# Altium schematic sheet PL_Conenctor.schDoc
size A3; SheetNumber: 1; SheetTotal: 13
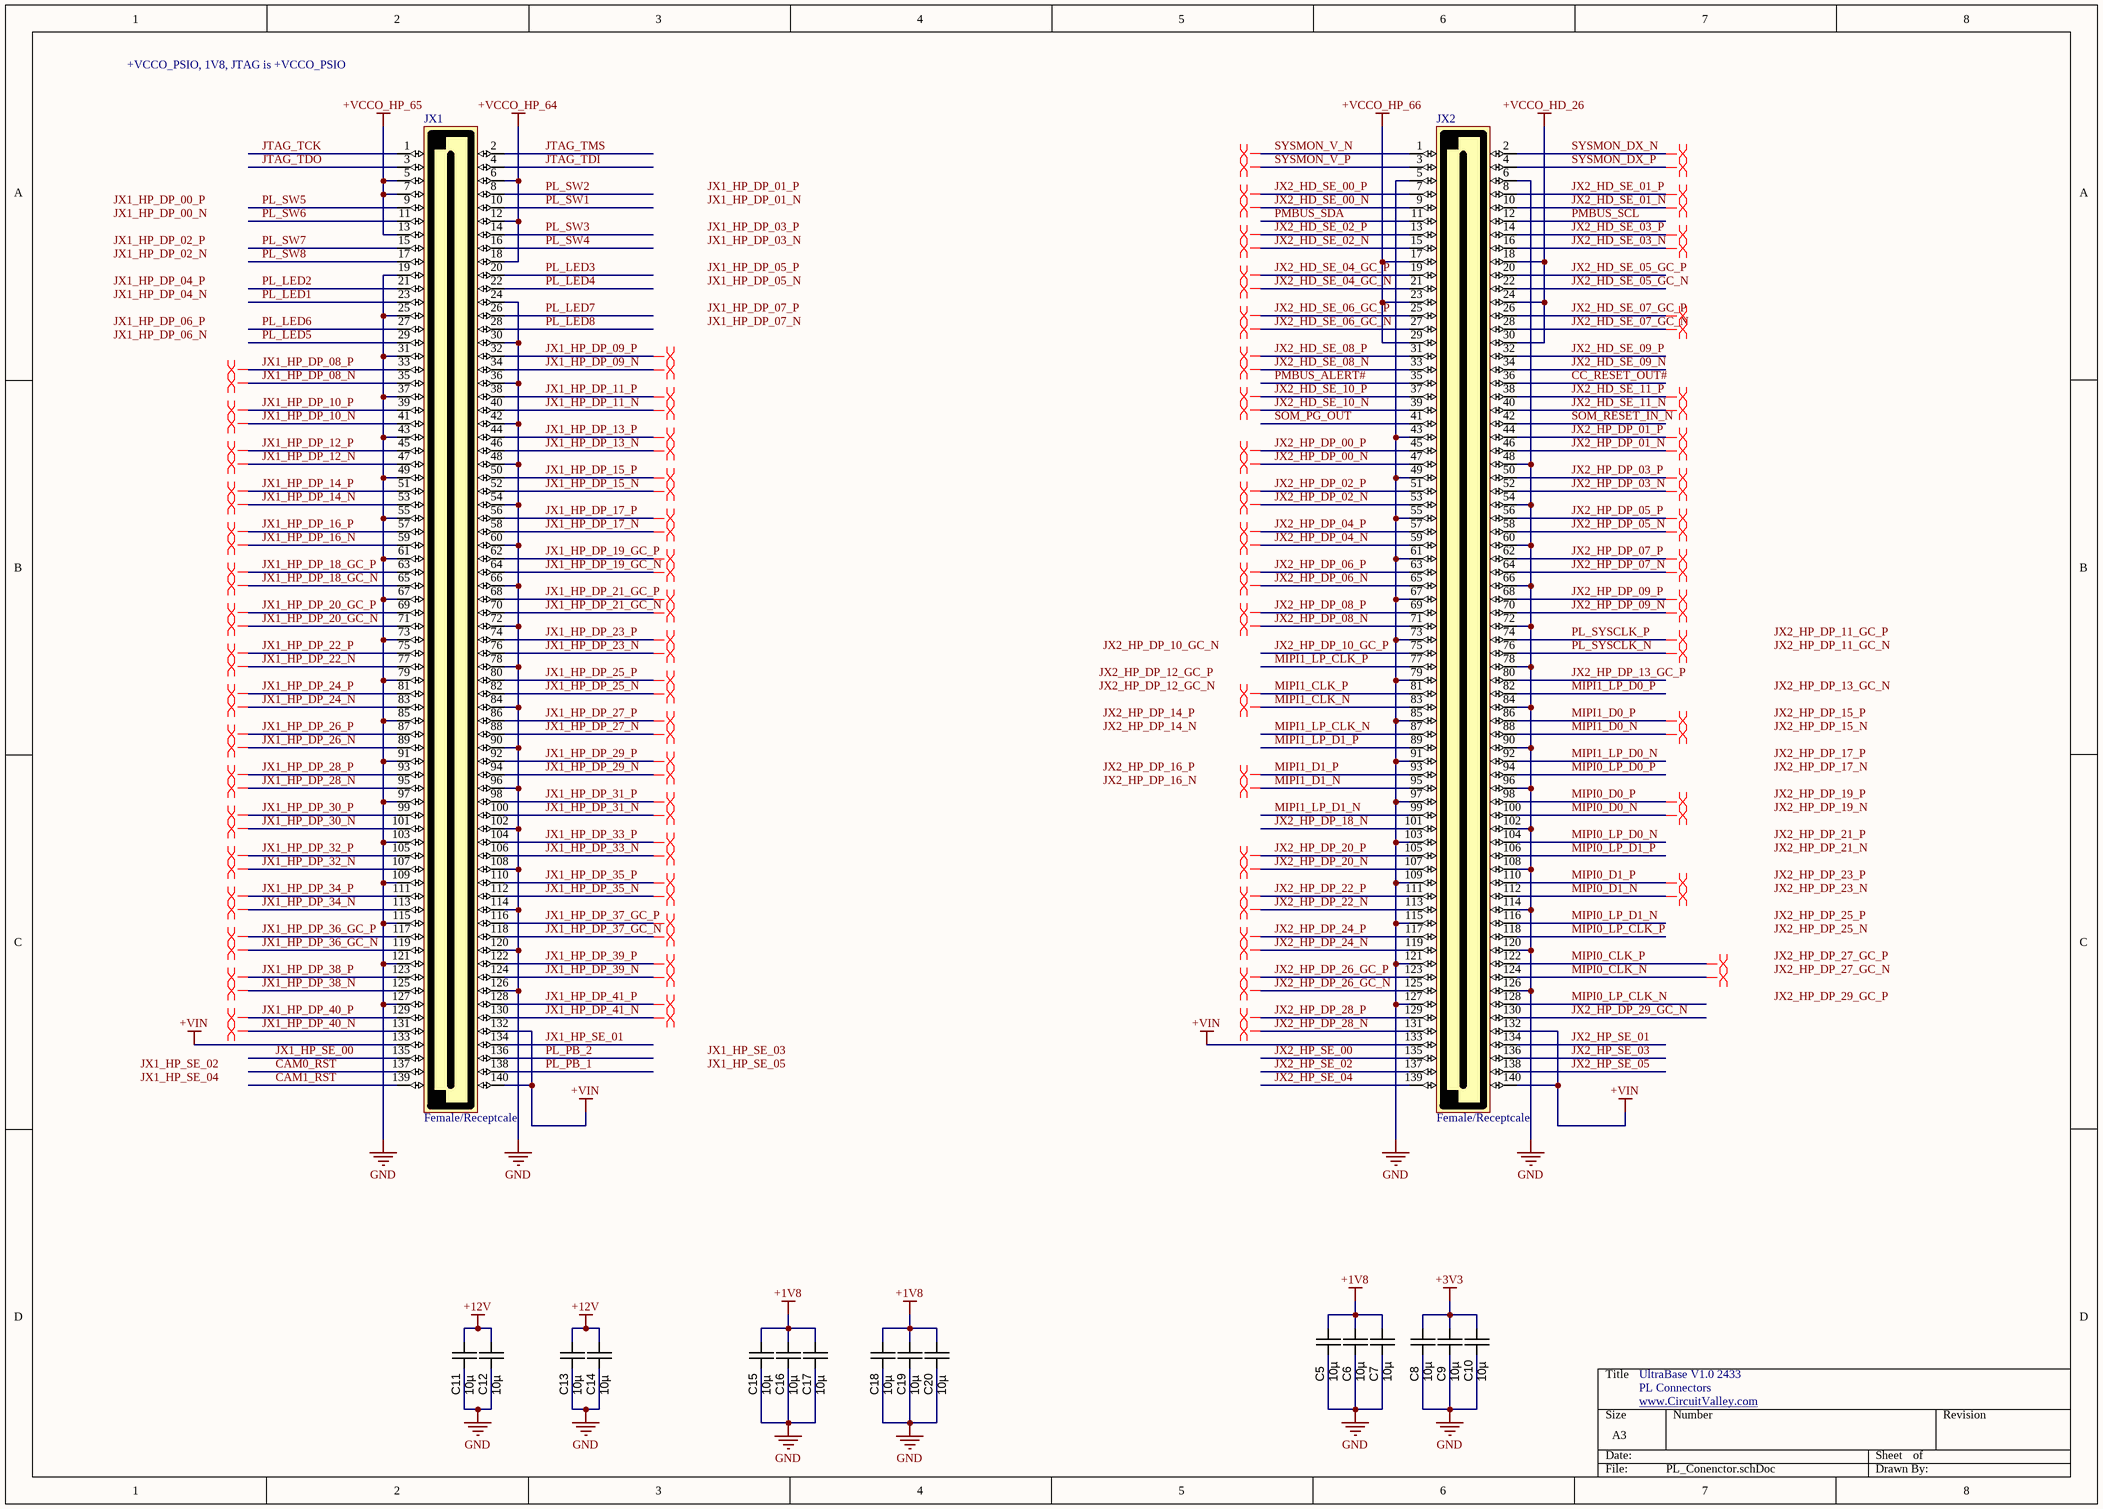
[diagram p0: PL_Conenctor.schDoc]

## Parts
C5  10µ  [CAPC3225N]
C6  10µ  [CAPC3225N]
C7  10µ  [CAPC3225N]
C8  10µ  [CAPC3225N]
C9  10µ  [CAPC3225N]
C10  10µ  [CAPC3225N]
C11  10µ  [CAPC3225N]
C12  10µ  [CAPC3225N]
C13  10µ  [CAPC3225N]
C14  10µ  [CAPC3225N]
C15  10µ  [CAPC3225N]
C16  10µ  [CAPC3225N]
C17  10µ  [CAPC3225N]
C18  10µ  [CAPC3225N]
C19  10µ  [CAPC3225N]
C20  10µ  [CAPC3225N]
JX1  Female/Receptcale  [5177985-6]
JX2  Female/Receptcale  [5177985-6]

## Nets
+1V8: C5.1 C6.1 C7.1 C15.1 C16.1 C17.1 C18.1 C19.1 C20.1
+3V3: C8.1 C9.1 C10.1
+12V: C11.1 C12.1 C13.1 C14.1
+VCCO_HD_26: JX2.18 JX2.24 JX2.30
+VCCO_HP_64: JX1.6 JX1.12 JX1.18
+VCCO_HP_65: JX1.5 JX1.7 JX1.13
+VCCO_HP_66: JX2.17 JX2.23 JX2.29
+VIN: JX1.132 JX1.133 JX1.140 JX2.132 JX2.133 JX2.140
GND: C5.2 C6.2 C7.2 C8.2 C9.2 C10.2 C11.2 C12.2 C13.2 C14.2 C15.2 C16.2 C17.2 C18.2 C19.2 C20.2 JX1.19 JX1.24 JX1.25 JX1.30 JX1.31 JX1.36 JX1.37 JX1.42 JX1.43 JX1.48 JX1.49 JX1.54 JX1.55 JX1.60 JX1.61 JX1.66 JX1.67 JX1.72 JX1.73 JX1.78 JX1.79 JX1.84 JX1.85 JX1.90 JX1.91 JX1.96 JX1.97 JX1.102 JX1.103 JX1.108 JX1.109 JX1.114 JX1.115 JX1.120 JX1.121 JX1.126 JX1.127 JX2.5 JX2.6 JX2.43 JX2.48 JX2.49 JX2.54 JX2.55 JX2.60 JX2.61 JX2.66 JX2.67 JX2.72 JX2.73 JX2.78 JX2.79 JX2.84 JX2.85 JX2.90 JX2.91 JX2.96 JX2.97 JX2.102 JX2.103 JX2.108 JX2.109 JX2.114 JX2.115 JX2.120 JX2.121 JX2.126 JX2.127
CAM0_RST: JX1.137
CAM1_RST: JX1.139
CC_RESET_OUT#: JX2.36
JTAG_TCK: JX1.1
JTAG_TDI: JX1.4
JTAG_TDO: JX1.3
JTAG_TMS: JX1.2
JX1_HP_DP_08_N: JX1.35
JX1_HP_DP_08_P: JX1.33
JX1_HP_DP_09_N: JX1.34
JX1_HP_DP_09_P: JX1.32
JX1_HP_DP_10_N: JX1.41
JX1_HP_DP_10_P: JX1.39
JX1_HP_DP_11_N: JX1.40
JX1_HP_DP_11_P: JX1.38
JX1_HP_DP_12_N: JX1.47
JX1_HP_DP_12_P: JX1.45
JX1_HP_DP_13_N: JX1.46
JX1_HP_DP_13_P: JX1.44
JX1_HP_DP_14_N: JX1.53
JX1_HP_DP_14_P: JX1.51
JX1_HP_DP_15_N: JX1.52
JX1_HP_DP_15_P: JX1.50
JX1_HP_DP_16_N: JX1.59
JX1_HP_DP_16_P: JX1.57
JX1_HP_DP_17_N: JX1.58
JX1_HP_DP_17_P: JX1.56
JX1_HP_DP_18_GC_N: JX1.65
JX1_HP_DP_18_GC_P: JX1.63
JX1_HP_DP_19_GC_N: JX1.64
JX1_HP_DP_19_GC_P: JX1.62
JX1_HP_DP_20_GC_N: JX1.71
JX1_HP_DP_20_GC_P: JX1.69
JX1_HP_DP_21_GC_N: JX1.70
JX1_HP_DP_21_GC_P: JX1.68
JX1_HP_DP_22_N: JX1.77
JX1_HP_DP_22_P: JX1.75
JX1_HP_DP_23_N: JX1.76
JX1_HP_DP_23_P: JX1.74
JX1_HP_DP_24_N: JX1.83
JX1_HP_DP_24_P: JX1.81
JX1_HP_DP_25_N: JX1.82
JX1_HP_DP_25_P: JX1.80
JX1_HP_DP_26_N: JX1.89
JX1_HP_DP_26_P: JX1.87
JX1_HP_DP_27_N: JX1.88
JX1_HP_DP_27_P: JX1.86
JX1_HP_DP_28_N: JX1.95
JX1_HP_DP_28_P: JX1.93
JX1_HP_DP_29_N: JX1.94
JX1_HP_DP_29_P: JX1.92
JX1_HP_DP_30_N: JX1.101
JX1_HP_DP_30_P: JX1.99
JX1_HP_DP_31_N: JX1.100
JX1_HP_DP_31_P: JX1.98
JX1_HP_DP_32_N: JX1.107
JX1_HP_DP_32_P: JX1.105
JX1_HP_DP_33_N: JX1.106
JX1_HP_DP_33_P: JX1.104
JX1_HP_DP_34_N: JX1.113
JX1_HP_DP_34_P: JX1.111
JX1_HP_DP_35_N: JX1.112
JX1_HP_DP_35_P: JX1.110
JX1_HP_DP_36_GC_N: JX1.119
JX1_HP_DP_36_GC_P: JX1.117
JX1_HP_DP_37_GC_N: JX1.118
JX1_HP_DP_37_GC_P: JX1.116
JX1_HP_DP_38_N: JX1.125
JX1_HP_DP_38_P: JX1.123
JX1_HP_DP_39_N: JX1.124
JX1_HP_DP_39_P: JX1.122
JX1_HP_DP_40_N: JX1.131
JX1_HP_DP_40_P: JX1.129
JX1_HP_DP_41_N: JX1.130
JX1_HP_DP_41_P: JX1.128
JX1_HP_SE_00: JX1.135
JX1_HP_SE_01: JX1.134
JX2_HD_SE_00_N: JX2.9
JX2_HD_SE_00_P: JX2.7
JX2_HD_SE_01_N: JX2.10
JX2_HD_SE_01_P: JX2.8
JX2_HD_SE_02_N: JX2.15
JX2_HD_SE_02_P: JX2.13
JX2_HD_SE_03_N: JX2.16
JX2_HD_SE_03_P: JX2.14
JX2_HD_SE_04_GC_N: JX2.21
JX2_HD_SE_04_GC_P: JX2.19
JX2_HD_SE_05_GC_N: JX2.22
JX2_HD_SE_05_GC_P: JX2.20
JX2_HD_SE_06_GC_N: JX2.27
JX2_HD_SE_06_GC_P: JX2.25
JX2_HD_SE_07_GC_N: JX2.28
JX2_HD_SE_07_GC_P: JX2.26
JX2_HD_SE_08_N: JX2.33
JX2_HD_SE_08_P: JX2.31
JX2_HD_SE_09_N: JX2.34
JX2_HD_SE_09_P: JX2.32
JX2_HD_SE_10_N: JX2.39
JX2_HD_SE_10_P: JX2.37
JX2_HD_SE_11_N: JX2.40
JX2_HD_SE_11_P: JX2.38
JX2_HP_DP_00_N: JX2.47
JX2_HP_DP_00_P: JX2.45
JX2_HP_DP_01_N: JX2.46
JX2_HP_DP_01_P: JX2.44
JX2_HP_DP_02_N: JX2.53
JX2_HP_DP_02_P: JX2.51
JX2_HP_DP_03_N: JX2.52
JX2_HP_DP_03_P: JX2.50
JX2_HP_DP_04_N: JX2.59
JX2_HP_DP_04_P: JX2.57
JX2_HP_DP_05_N: JX2.58
JX2_HP_DP_05_P: JX2.56
JX2_HP_DP_06_N: JX2.65
JX2_HP_DP_06_P: JX2.63
JX2_HP_DP_07_N: JX2.64
JX2_HP_DP_07_P: JX2.62
JX2_HP_DP_08_N: JX2.71
JX2_HP_DP_08_P: JX2.69
JX2_HP_DP_09_N: JX2.70
JX2_HP_DP_09_P: JX2.68
JX2_HP_DP_10_GC_P: JX2.75
JX2_HP_DP_13_GC_P: JX2.80
JX2_HP_DP_18_N: JX2.101
JX2_HP_DP_20_N: JX2.107
JX2_HP_DP_20_P: JX2.105
JX2_HP_DP_22_N: JX2.113
JX2_HP_DP_22_P: JX2.111
JX2_HP_DP_24_N: JX2.119
JX2_HP_DP_24_P: JX2.117
JX2_HP_DP_26_GC_N: JX2.125
JX2_HP_DP_26_GC_P: JX2.123
JX2_HP_DP_28_N: JX2.131
JX2_HP_DP_28_P: JX2.129
JX2_HP_DP_29_GC_N: JX2.130
JX2_HP_SE_00: JX2.135
JX2_HP_SE_01: JX2.134
JX2_HP_SE_02: JX2.137
JX2_HP_SE_03: JX2.136
JX2_HP_SE_04: JX2.139
JX2_HP_SE_05: JX2.138
MIPI0_CLK_N: JX2.124
MIPI0_CLK_P: JX2.122
MIPI0_D0_N: JX2.100
MIPI0_D0_P: JX2.98
MIPI0_D1_N: JX2.112
MIPI0_D1_P: JX2.110
MIPI0_LP_CLK_N: JX2.128
MIPI0_LP_CLK_P: JX2.118
MIPI0_LP_D0_N: JX2.104
MIPI0_LP_D0_P: JX2.94
MIPI0_LP_D1_N: JX2.116
MIPI0_LP_D1_P: JX2.106
MIPI1_CLK_N: JX2.83
MIPI1_CLK_P: JX2.81
MIPI1_D0_N: JX2.88
MIPI1_D0_P: JX2.86
MIPI1_D1_N: JX2.95
MIPI1_D1_P: JX2.93
MIPI1_LP_CLK_N: JX2.87
MIPI1_LP_CLK_P: JX2.77
MIPI1_LP_D0_N: JX2.92
MIPI1_LP_D0_P: JX2.82
MIPI1_LP_D1_N: JX2.99
MIPI1_LP_D1_P: JX2.89
PL_LED1: JX1.23
PL_LED2: JX1.21
PL_LED3: JX1.20
PL_LED4: JX1.22
PL_LED5: JX1.29
PL_LED6: JX1.27
PL_LED7: JX1.26
PL_LED8: JX1.28
PL_PB_1: JX1.138
PL_PB_2: JX1.136
PL_SW1: JX1.10
PL_SW2: JX1.8
PL_SW3: JX1.14
PL_SW4: JX1.16
PL_SW5: JX1.9
PL_SW6: JX1.11
PL_SW7: JX1.15
PL_SW8: JX1.17
PL_SYSCLK_N: JX2.76
PL_SYSCLK_P: JX2.74
PMBUS_ALERT#: JX2.35
PMBUS_SCL: JX2.12
PMBUS_SDA: JX2.11
SOM_PG_OUT: JX2.41
SOM_RESET_IN_N: JX2.42
SYSMON_DX_N: JX2.2
SYSMON_DX_P: JX2.4
SYSMON_V_N: JX2.1
SYSMON_V_P: JX2.3

## Layout directives
differential pair: JX1_HP_DP_08_N, JX1_HP_DP_08_P, JX1_HP_DP_09_N, JX1_HP_DP_09_P, JX1_HP_DP_10_N, JX1_HP_DP_10_P, JX1_HP_DP_11_N, JX1_HP_DP_11_P, JX1_HP_DP_12_N, JX1_HP_DP_12_P, JX1_HP_DP_13_N, JX1_HP_DP_13_P, JX1_HP_DP_14_N, JX1_HP_DP_14_P, JX1_HP_DP_15_N, JX1_HP_DP_15_P, JX1_HP_DP_16_N, JX1_HP_DP_16_P, JX1_HP_DP_17_N, JX1_HP_DP_17_P, JX1_HP_DP_18_GC_N, JX1_HP_DP_18_GC_P, JX1_HP_DP_19_GC_N, JX1_HP_DP_19_GC_P, JX1_HP_DP_20_GC_N, JX1_HP_DP_20_GC_P, JX1_HP_DP_21_GC_N, JX1_HP_DP_21_GC_P, JX1_HP_DP_22_N, JX1_HP_DP_22_P, JX1_HP_DP_23_N, JX1_HP_DP_23_P, JX1_HP_DP_24_N, JX1_HP_DP_24_P, JX1_HP_DP_25_N, JX1_HP_DP_25_P, JX1_HP_DP_26_N, JX1_HP_DP_26_P, JX1_HP_DP_27_N, JX1_HP_DP_27_P, JX1_HP_DP_28_N, JX1_HP_DP_28_P, JX1_HP_DP_29_N, JX1_HP_DP_29_P, JX1_HP_DP_30_N, JX1_HP_DP_30_P, JX1_HP_DP_31_N, JX1_HP_DP_31_P, JX1_HP_DP_32_N, JX1_HP_DP_32_P, JX1_HP_DP_33_N, JX1_HP_DP_33_P, JX1_HP_DP_34_N, JX1_HP_DP_34_P, JX1_HP_DP_35_N, JX1_HP_DP_35_P, JX1_HP_DP_36_GC_N, JX1_HP_DP_36_GC_P, JX1_HP_DP_37_GC_N, JX1_HP_DP_37_GC_P, JX1_HP_DP_38_N, JX1_HP_DP_38_P, JX1_HP_DP_39_N, JX1_HP_DP_39_P, JX1_HP_DP_40_N, JX1_HP_DP_40_P, JX1_HP_DP_41_N, JX1_HP_DP_41_P, JX2_HD_SE_00_N, JX2_HD_SE_00_P, JX2_HD_SE_01_N, JX2_HD_SE_01_P, JX2_HD_SE_02_N, JX2_HD_SE_02_P, JX2_HD_SE_03_N, JX2_HD_SE_03_P, JX2_HD_SE_04_GC_N, JX2_HD_SE_04_GC_P, JX2_HD_SE_06_GC_N, JX2_HD_SE_06_GC_P, JX2_HD_SE_07_GC_N, JX2_HD_SE_07_GC_P, JX2_HD_SE_08_N, JX2_HD_SE_08_P, JX2_HD_SE_10_N, JX2_HD_SE_10_P, JX2_HD_SE_11_N, JX2_HD_SE_11_P, JX2_HP_DP_00_N, JX2_HP_DP_00_P, JX2_HP_DP_01_N, JX2_HP_DP_01_P, JX2_HP_DP_02_N, JX2_HP_DP_02_P, JX2_HP_DP_03_N, JX2_HP_DP_03_P, JX2_HP_DP_04_N, JX2_HP_DP_04_P, JX2_HP_DP_05_N, JX2_HP_DP_05_P, JX2_HP_DP_06_N, JX2_HP_DP_06_P, JX2_HP_DP_07_N, JX2_HP_DP_07_P, JX2_HP_DP_08_N, JX2_HP_DP_08_P, JX2_HP_DP_09_N, JX2_HP_DP_09_P, JX2_HP_DP_20_N, JX2_HP_DP_20_P, JX2_HP_DP_22_N, JX2_HP_DP_22_P, JX2_HP_DP_24_N, JX2_HP_DP_24_P, JX2_HP_DP_26_GC_N, JX2_HP_DP_26_GC_P, JX2_HP_DP_28_N, JX2_HP_DP_28_P, MIPI0_CLK_N, MIPI0_CLK_P, MIPI0_D0_N, MIPI0_D0_P, MIPI0_D1_N, MIPI0_D1_P, MIPI1_CLK_N, MIPI1_CLK_P, MIPI1_D0_N, MIPI1_D0_P, MIPI1_D1_N, MIPI1_D1_P, PL_SYSCLK_N, PL_SYSCLK_P, SYSMON_DX_N, SYSMON_DX_P, SYSMON_V_N, SYSMON_V_P

## Notes on the sheet
- +VCCO_PSIO, 1V8, JTAG is +VCCO_PSIO
- UltraBase V1.0 2433
- PL Connectors
- www.CircuitValley.com <http://www.CircuitValley.com>
- Labels drawn without touching a wire or pin: JX1_HP_DP_00_N, JX1_HP_DP_00_P, JX1_HP_DP_01_N, JX1_HP_DP_01_P, JX1_HP_DP_02_N, JX1_HP_DP_02_P, JX1_HP_DP_03_N, JX1_HP_DP_03_P, JX1_HP_DP_04_N, JX1_HP_DP_04_P, JX1_HP_DP_05_N, JX1_HP_DP_05_P, JX1_HP_DP_06_N, JX1_HP_DP_06_P, JX1_HP_DP_07_N, JX1_HP_DP_07_P, JX1_HP_SE_02, JX1_HP_SE_03, JX1_HP_SE_04, JX1_HP_SE_05, JX2_HP_DP_10_GC_N, JX2_HP_DP_11_GC_N, JX2_HP_DP_11_GC_P, JX2_HP_DP_12_GC_N, JX2_HP_DP_12_GC_P, JX2_HP_DP_13_GC_N, JX2_HP_DP_14_N, JX2_HP_DP_14_P, JX2_HP_DP_15_N, JX2_HP_DP_15_P, JX2_HP_DP_16_N, JX2_HP_DP_16_P, JX2_HP_DP_17_N, JX2_HP_DP_17_P, JX2_HP_DP_19_N, JX2_HP_DP_19_P, JX2_HP_DP_21_N, JX2_HP_DP_21_P, JX2_HP_DP_23_N, JX2_HP_DP_23_P, JX2_HP_DP_25_N, JX2_HP_DP_25_P, JX2_HP_DP_27_GC_N, JX2_HP_DP_27_GC_P, JX2_HP_DP_29_GC_P

## Library data of the parts
C5-C20 = CAPC_10u_1210_50V: Capacitor SMD Cer 10uF 20% 16V X5R 1210; Manufacturer 1: Taiyo Yuden; Manufacturer Part Number 1: UMK325BJ106MM-T; Ratings: 50V; X5R; Material: ceramic; Package / Case: 1210 (3225 Metric); Tolerance: ±20%; Size / Dimension: 0.126" L x 0.098" W (3.20mm x 2.50mm); Supplier 1: Digi-Key; Supplier Part Number 1: 587-2225-1-ND; Value: 10µ
JX1 = 5177985-6_Ultrazed_JX1: 140 Pin Ultrascale  SOM Connector with ultrazed specific SOM net delay
JX2 = 5177985-6_Ultrazed_JX2: 140 Pin Ultrascale  SOM Connector with ultrazed specific SOM net delay